# Altium schematic sheet MCU.SchDoc
size 420 x 297 mm; SheetNumber: 1; Scale: {Мш.}; PageSetup: Record=PageOptions|CenterHorizontal=False|CenterVertical=False|PrintScale=0.49|XCorrection=0.00|YCorrection=0.00|PrintKind=1|BorderSize=5000000|LeftOffset=0|BottomOffset=0|Orientation=1|PaperLength=1000|PaperWidth=1000|Scale=100|PaperSource=15|PrintQuality=600|MediaType=1|DitherType=10|PrintScaleMode=1|PaperKind=A4; ProcessInspection: {Т.контр.}; Mass: {М.}; NormInspection: {Н.контр.}; Letter1Column: {}; Letter2Column: {}; Letter3Column: {}; DocumentType: {Документ}
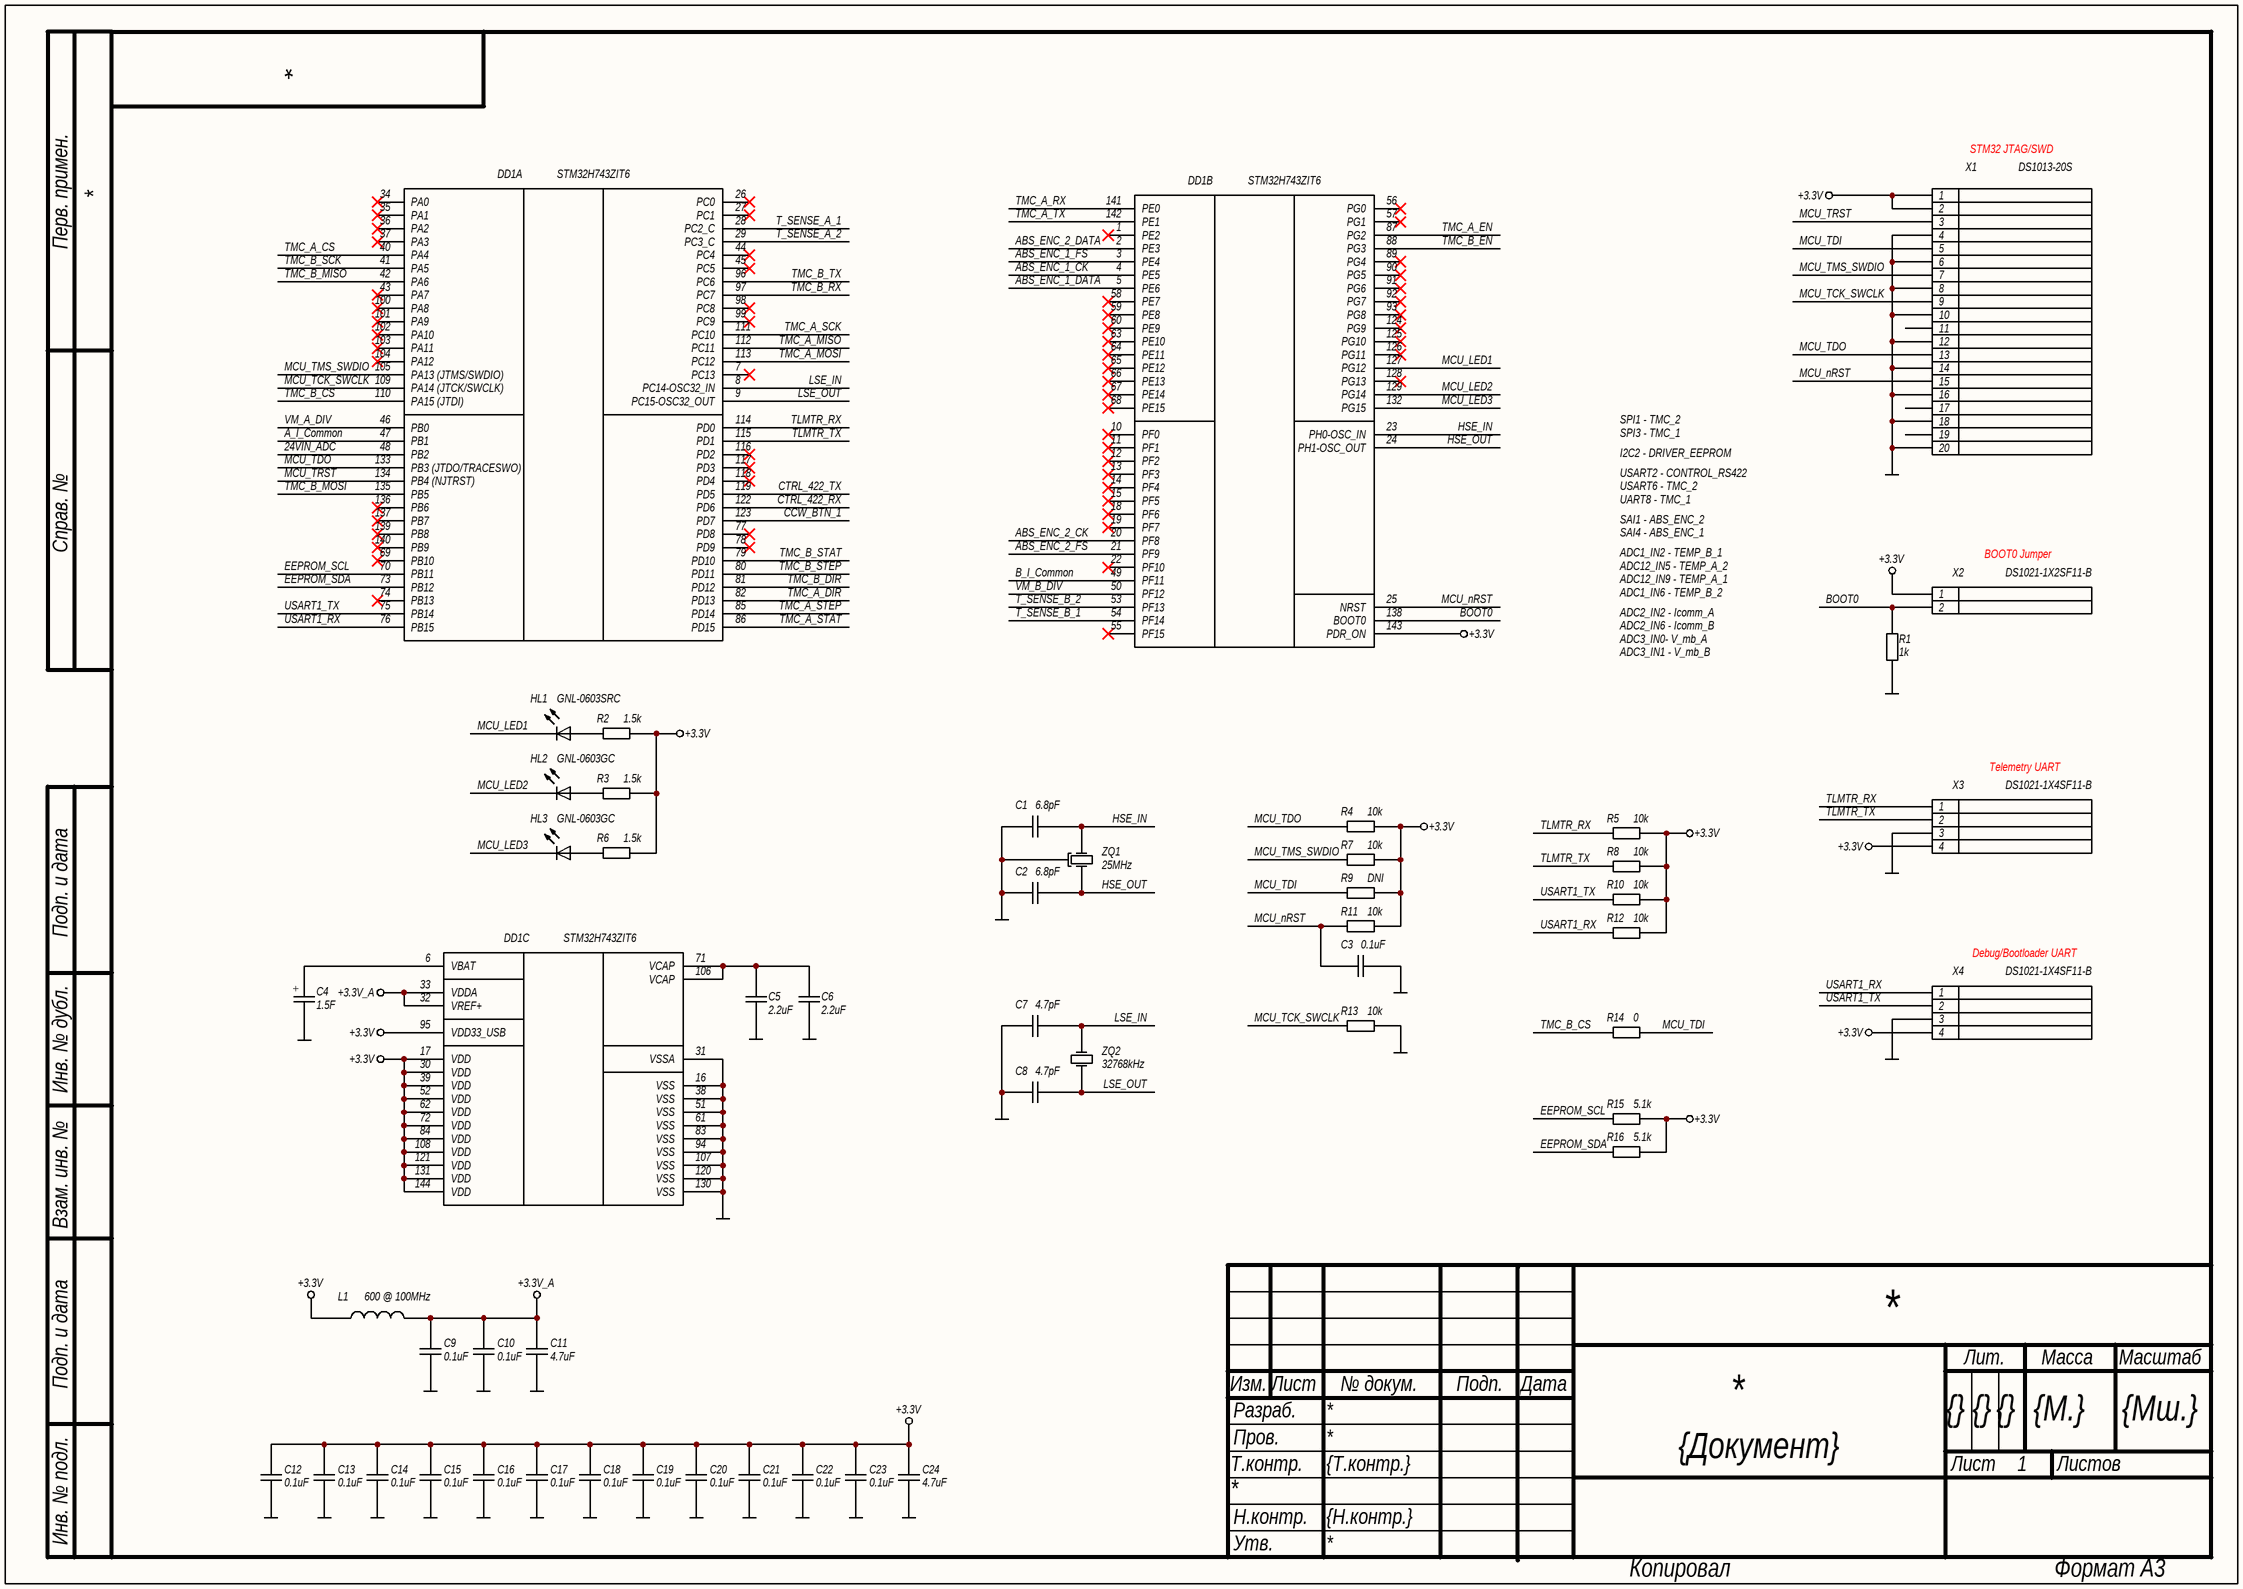
[diagram p0: MCU.SchDoc]

## Parts
C1  6.8pF  [C0603N]
C2  6.8pF  [C0603N]
C3  0.1uF  [C0603N]
C4  1.5F  [KR-5R5H155-R]
C5  2.2uF  [C0603N]
C6  2.2uF  [C0603N]
C7  4.7pF  [C0603N]
C8  4.7pF  [C0603N]
C9  0.1uF  [C0603N]
C10  0.1uF  [C0603N]
C11  4.7uF  [C0603N]
C12  0.1uF  [C0603N]
C13  0.1uF  [C0603N]
C14  0.1uF  [C0603N]
C15  0.1uF  [C0603N]
C16  0.1uF  [C0603N]
C17  0.1uF  [C0603N]
C18  0.1uF  [C0603N]
C19  0.1uF  [C0603N]
C20  0.1uF  [C0603N]
C21  0.1uF  [C0603N]
C22  0.1uF  [C0603N]
C23  0.1uF  [C0603N]
C24  4.7uF  [C0603N]
DD1  STM32H743ZIT6  [LQFP144]  (parts A,B,C of 3)
HL1  GNL-0603SRC  [LED0603]
HL2  GNL-0603GC  [LED0603]
HL3  GNL-0603GC  [LED0603]
L1  600 @ 100MHz  [FB0603N]
R1  1k  [R0603N]
R2  1.5k  [R0603N]
R3  1.5k  [R0603N]
R4  10k  [R0603N]
R5  10k  [R0603N]
R6  1.5k  [R0603N]
R7  10k  [R0603N]
R8  10k  [R0603N]
R9  DNI  [R0603N]  (no BOM)
R10  10k  [R0603N]
R11  10k  [R0603N]
R12  10k  [R0603N]
R13  10k  [R0603N]
R14  0  [R0603N]
R15  5.1k  [R0603N]
R16  5.1k  [R0603N]
X1  DS1013-20S  [2.54_2X10_HEADER_BOX]
X2  DS1021-1X2SF11-B  [2.54_2X1_HEADER]
X3  DS1021-1X4SF11-B  [2.54_4X1_HEADER]
X4  DS1021-1X4SF11-B  [2.54_4X1_HEADER]
ZQ1  25MHz  [NX3225GA]
ZQ2  32768kHz  [NX3215SA]

## Nets
+3.3V: C12.2 C13.2 C14.2 C15.2 C16.2 C17.2 C18.2 C19.2 C20.2 C21.2 C22.2 C23.2 C24.2 DD1.17(VDD) DD1.30(VDD) DD1.39(VDD) DD1.52(VDD) DD1.62(VDD) DD1.72(VDD) DD1.84(VDD) DD1.95(VDD33_USB) DD1.108(VDD) DD1.121(VDD) DD1.131(VDD) DD1.143(PDR_ON) DD1.144(VDD) L1.1 R2.1 R3.1 R4.1 R5.1 R6.1 R7.1 R8.1 R9.1 R10.1 R11.1 R12.1 R15.1 R16.1 X1.1 X1.2 X2.1 X3.4 X4.4
+3.3V_A: C9.2 C10.2 C11.2 DD1.32(VREF+) DD1.33(VDDA) L1.2
GND: C1.2 C2.2 C3.1 C4.1 C5.1 C6.1 C7.2 C8.2 C9.1 C10.1 C11.1 C12.1 C13.1 C14.1 C15.1 C16.1 C17.1 C18.1 C19.1 C20.1 C21.1 C22.1 C23.1 C24.1 DD1.16(VSS) DD1.31(VSSA) DD1.38(VSS) DD1.51(VSS) DD1.61(VSS) DD1.83(VSS) DD1.94(VSS) DD1.107(VSS) DD1.120(VSS) DD1.130(VSS) R1.2 R13.2 X1.4 X1.6 X1.8 X1.10 X1.12 X1.14 X1.16 X1.18 X1.20 X3.3 X4.3 ZQ1.2
24VIN_ADC: DD1.48(PB2)
A_I_Common: DD1.47(PB1)
ABS_ENC_1_CK: DD1.4(PE5)
ABS_ENC_1_DATA: DD1.5(PE6)
ABS_ENC_1_FS: DD1.3(PE4)
ABS_ENC_2_CK: DD1.20(PF8)
ABS_ENC_2_DATA: DD1.2(PE3)
ABS_ENC_2_FS: DD1.21(PF9)
B_I_Common: DD1.49(PF11)
BOOT0: DD1.138(BOOT0) R1.1 X2.2
CCW_BTN_1: DD1.123(PD7)
CTRL_422_RX: DD1.122(PD6)
CTRL_422_TX: DD1.119(PD5)
EEPROM_SCL: DD1.70(PB11) R15.2
EEPROM_SDA: DD1.73(PB12) R16.2
HSE_IN: C1.1 DD1.23(PH0-OSC_IN) ZQ1.1
HSE_OUT: C2.1 DD1.24(PH1-OSC_OUT) ZQ1.3
LSE_IN: C7.1 DD1.8(PC14-OSC32_IN) ZQ2.2
LSE_OUT: C8.1 DD1.9(PC15-OSC32_OUT) ZQ2.1
MCU_LED1: DD1.127(PG12) HL1.1(K)
MCU_LED2: DD1.129(PG14) HL2.1(K)
MCU_LED3: DD1.132(PG15) HL3.1(K)
MCU_nRST: C3.2 DD1.25(NRST) R11.2 X1.15
MCU_TCK_SWCLK: DD1.109(PA14_(JTCK/SWCLK)) R13.1 X1.9
MCU_TDI: R9.2 R14.1 X1.5
MCU_TDO: DD1.133(PB3_(JTDO/TRACESWO)) R4.2 X1.13
MCU_TMS_SWDIO: DD1.105(PA13_(JTMS/SWDIO)) R7.2 X1.7
MCU_TRST: DD1.134(PB4_(NJTRST)) X1.3
T_SENSE_A_1: DD1.28(PC2_C)
T_SENSE_A_2: DD1.29(PC3_C)
T_SENSE_B_1: DD1.54(PF14)
T_SENSE_B_2: DD1.53(PF13)
TLMTR_RX: DD1.114(PD0) R5.2 X3.1
TLMTR_TX: DD1.115(PD1) R8.2 X3.2
TMC_A_CS: DD1.40(PA4)
TMC_A_DIR: DD1.82(PD13)
TMC_A_EN: DD1.87(PG2)
TMC_A_MISO: DD1.112(PC11)
TMC_A_MOSI: DD1.113(PC12)
TMC_A_RX: DD1.141(PE0)
TMC_A_SCK: DD1.111(PC10)
TMC_A_STAT: DD1.86(PD15)
TMC_A_STEP: DD1.85(PD14)
TMC_A_TX: DD1.142(PE1)
TMC_B_CS: DD1.110(PA15_(JTDI)) R14.2
TMC_B_DIR: DD1.81(PD12)
TMC_B_EN: DD1.88(PG3)
TMC_B_MISO: DD1.42(PA6)
TMC_B_MOSI: DD1.135(PB5)
TMC_B_RX: DD1.97(PC7)
TMC_B_SCK: DD1.41(PA5)
TMC_B_STAT: DD1.79(PD10)
TMC_B_STEP: DD1.80(PD11)
TMC_B_TX: DD1.96(PC6)
USART1_RX: DD1.76(PB15) R12.2 X4.1
USART1_TX: DD1.75(PB14) R10.2 X4.2
VM_A_DIV: DD1.46(PB0)
VM_B_DIV: DD1.50(PF12)
NetC4_2: C4.2 DD1.6(VBAT)
NetC5_2: C5.2 C6.2 DD1.71(VCAP) DD1.106(VCAP)
NetHL1_2: HL1.2(A) R2.2
NetHL2_2: HL2.2(A) R3.2
NetHL3_2: HL3.2(A) R6.2

Not connected (* = marked no-connect by the designer): DD1 1(PE2)* 7(PC13)* 10(PF0)* 11(PF1)* 12(PF2)* 13(PF3)* 14(PF4)* 15(PF5)* 18(PF6)* 19(PF7)* 22(PF10)* 26(PC0)* 27(PC1)* 34(PA0)* 35(PA1)* 36(PA2)* 37(PA3)* 43(PA7)* 44(PC4)* 45(PC5)* 55(PF15)* 56(PG0)* 57(PG1)* 58(PE7)* 59(PE8)* 60(PE9)* 63(PE10)* 64(PE11)* 65(PE12)* 66(PE13)* 67(PE14)* 68(PE15)* 69(PB10)* 74(PB13)* 77(PD8)* 78(PD9)* 89(PG4)* 90(PG5)* 91(PG6)* 92(PG7)* 93(PG8)* 98(PC8)* 99(PC9)* 100(PA8)* 101(PA9)* 102(PA10)* 103(PA11)* 104(PA12)* 116(PD2)* 117(PD3)* 118(PD4)* 124(PG9)* 125(PG10)* 126(PG11)* 128(PG13)* 136(PB6)* 137(PB7)* 139(PB8)* 140(PB9)*; X1 11 17 19

## Notes on the sheet
- STM32 JTAG/SWD
- SPI1 - TMC_2
- SPI3 - TMC_1
- I2C2 - DRIVER_EEPROM
- USART2 - CONTROL_RS422
- USART6 - TMC_2
- UART8 - TMC_1
- SAI1 - ABS_ENC_2
- ADC1_IN2 - TEMP_B_1
- ADC12_IN5 - TEMP_A_2
- ADC12_IN9 - TEMP_A_1
- ADC1_IN6 - TEMP_B_2
- SAI4 - ABS_ENC_1
- BOOT0 Jumper
- ADC2_IN2 - Icomm_A
- ADC2_IN6 - Icomm_B
- ADC3_IN0- V_mb_A
- ADC3_IN1 - V_mb_B
- Telemetry UART
- (near X4) Debug/Bootloader UART
- Перв. примен.
- Справ. №
- Подп. и дата
- Инв. № дубл.
- Взам. инв. №
- Изм.
- Лист
- № докум.
- Подп.
- Дата
- Лит.
- Масса
- Масштаб
- Т.контр.
- Пров.
- Разраб.
- Листов
- Инв. № подл.
- Н.контр.
- Утв.
- Копировал
- Формат А3
- (in symbol KR-5R5H155-R) +

## Library data of the parts
C1 C2 = CC0603CRNPO9BN6R8: Конденсатор; Точность: ±0.25pF; Напряжение: 50V; Диэлектрик: NP0; Производитель: YAGEO; Описание: 4.7 pF ±0.25pF 50V Ceramic Capacitor C0G, NP0 0603 (1608 Metric); Корпус: 0603 (1608 Metric); Температурный диапазон: -55°C ~ 125°C; Вид монтажа: SMD; Артикул: CC0603CRNPO9BN6R8; Номинал: 6.8pF; Строка для документации: https://www.yageo.com/upload/media/product/productsearch/datasheet/mlcc/UPY-GP_NP0_16V-to-50V_18.pdf; Тип элемента: Конденсатор
C3 C9 C10 C12-C23 = CL10B104KB8NNNC: Конденсатор; Точность: 10%; Напряжение: 50V; Диэлектрик: X7R; Производитель: Samsung Electro-Mechanics; Описание: 0.1 µF ±10% 50V Ceramic Capacitor X7R 0603 (1608 Metric); Корпус: 0603 (1608 Metric); Температурный диапазон: -55°C ~ 125°C; Вид монтажа: SMD; Артикул: CL10B104KB8NNNC; Номинал: 0.1uF; Строка для документации: https://mm.digikey.com/Volume0/opasdata/d220001/medias/docus/609/CL10B104KB8NNNC_Spec.pdf; Тип элемента: Конденсатор
C4 = KR-5R5H155-R: Ионистор; Точность: -20%, +80%; Напряжение: 5.5V; Диэлектрик: EDLC; Производитель: Eaton - Electronics Division; Описание: 1.5 F (EDLC) Supercapacitor 5.5 V Axial, Can - Horizontal 30Ohm @ 1kHz 1000 Hrs @ 70°C; Корпус: 19.00mm dia x 6.5mm; Температурный диапазон: -25°C ~ 70°C; Вид монтажа: Through Hole; Тип элемента: Конденсатор; Артикул: KR-5R5H155-R; Номинал: 1.5F; Строка для документации: https://www.eaton.com/content/dam/eaton/products/electronic-components/resources/data-sheet/eaton-kr-supercapacitors-coin-cells-data-sheet.pdf
C5 C6 = CL10A225KO8NNNC: Конденсатор; Точность: 10%; Напряжение: 16V; Диэлектрик: X5R; Производитель: Samsung Electro-Mechanics; Описание: 2.2 µF ±10% 16V Ceramic Capacitor X5R 0603 (1608 Metric); Корпус: 0603 (1608 Metric); Температурный диапазон: -55°C ~ 85°C; Вид монтажа: SMD; Артикул: CL10A225KO8NNNC; Номинал: 2.2uF; Строка для документации: https://mm.digikey.com/Volume0/opasdata/d220001/medias/docus/421/CL10A225KO8NNNC_Spec.pdf; Тип элемента: Конденсатор
C7 C8 = CC0603CRNPO9BN4R7: Конденсатор; Точность: ±0.25pF; Напряжение: 50V; Диэлектрик: NP0; Производитель: YAGEO; Описание: 4.7 pF ±0.25pF 50V Ceramic Capacitor C0G, NP0 0603 (1608 Metric); Корпус: 0603 (1608 Metric); Температурный диапазон: -55°C ~ 125°C; Вид монтажа: SMD; Артикул: CC0603CRNPO9BN4R7; Номинал: 4.7pF; Строка для документации: https://www.yageo.com/upload/media/product/productsearch/datasheet/mlcc/UPY-GP_NP0_16V-to-50V_18.pdf; Тип элемента: Конденсатор
C11 C24 = CL10A475KO8NNNC: Конденсатор; Точность: 10%; Напряжение: 16V; Диэлектрик: X5R; Производитель: Samsung Electro-Mechanics; Описание: 4.7 µF ±10% 16V Ceramic Capacitor X5R 0603 (1608 Metric); Корпус: 0603 (1608 Metric); Температурный диапазон: -55°C ~ 85°C; Вид монтажа: SMD; Артикул: CL10A475KO8NNNC; Номинал: 4.7uF; Строка для документации: https://mm.digikey.com/Volume0/opasdata/d220001/medias/docus/2328/CL10A475KO8NNNC_Spec.pdf; Тип элемента: Конденсатор
DD1 = STM32H743ZIT6: Микросхема микроконтроллер; Производитель: STMicroelectronics; Описание: ARM® Cortex®-M7 STM32H7 Microcontroller IC 32-Bit Single-Core 480MHz 2MB (2M x 8) FLASH 144-LQFP (20x20); Корпус: 144-LQFP (20x20); Температурный диапазон: -40°C ~ 85°C (TA); Вид монтажа: SMD; Артикул: STM32H743ZIT6; Строка для документации: https://www.st.com/resource/en/datasheet/stm32h743bi.pdf; Тип элемента: Микросхема
HL1 = GNL-0603SRC: Светодиод; Прямой ток: 20mA; Напряжение: 2V; Яркость: 15mcd; Цвет: Зеленый; Длина волны: 660nm; Производитель: G-nor Electronics; Описание: Green 567nm LED Indication - Discrete 2V 0603 (1608 Metric); Корпус: 0603 (1608 Metric); Температурный диапазон: -40°C ~ 80°C; Вид монтажа: SMD; Тип элемента: Диод светоизлучающий; Артикул: GNL-0603SRC; Строка для документации: https://www.g-nor.com/Uploads/Ed/file/20210517/1621223120713818.doc
HL2 HL3 = GNL-0603GC: Светодиод; Прямой ток: 20mA; Напряжение: 2V; Цвет: Зеленый; Длина волны: 567nm; Производитель: G-nor Electronics; Описание: Green 567nm LED Indication - Discrete 2V 0603 (1608 Metric); Корпус: 0603 (1608 Metric); Температурный диапазон: -40°C ~ 80°C; Вид монтажа: SMD; Тип элемента: Диод светоизлучающий; Артикул: GNL-0603GC; Яркость: LED; Строка для документации: https://www.g-nor.com/Uploads/Ed/file/20210517/1621223120713818.doc
L1 = BLM18AG601SN1D: Фильтр ЭМП индуктивный; Ток: 500mA; Сопротивление: 380m; Тип: Ferrite Bead; Производитель: Murata Electronics; Описание: 600 Ohms @ 100 MHz 1 Ferrite Bead 0603 (1608 Metric) 500mA 380mOhm; Корпус: 0603 (1608 Metric); Температурный диапазон: -55°C ~ 125°C; Вид монтажа: SMD; Артикул: BLM18AG601SN1D; Номинал: 600 @ 100MHz; Строка для документации: https://www.murata.com/en-us/products/productdata/8796738650142/ENFA0003.pdf; Тип элемента: Фильтр ЭМП
R1 = RC0603FR-071KL: Резистор; Точность: 1%; ТКС: ±100ppm/°C; Напряжение: 75V; Производитель: YAGEO; Описание: 1 kOhms ±1% 0.1W, 1/10W Chip Resistor 0603 (1608 Metric) Moisture Resistant Thick Film; Корпус: 0603 (1608 Metric); Температурный диапазон: -55°C ~ 155°C; Вид монтажа: SMD; Артикул: RC0603FR-071KL; Номинал: 1k; Строка для документации: https://www.yageo.com/upload/media/product/app/datasheet/rchip/pyu-rc_group_51_rohs_l.pdf; Тип элемента: Резистор
R2 R3 R6 = RC0603FR-071K5L: Резистор; Точность: 1%; ТКС: ±100ppm/°C; Напряжение: 75V; Производитель: YAGEO; Описание: 1.5 kOhms ±1% 0.1W, 1/10W Chip Resistor 0603 (1608 Metric) Moisture Resistant Thick Film; Корпус: 0603 (1608 Metric); Температурный диапазон: -55°C ~ 155°C; Вид монтажа: SMD; Артикул: RC0603FR-071K5L; Номинал: 1.5k; Строка для документации: https://www.yageo.com/upload/media/product/app/datasheet/rchip/pyu-rc_group_51_rohs_l.pdf; Тип элемента: Резистор
R4 R5 R7-R13 = RC0603FR-0710KL: Резистор; Точность: 1%; ТКС: ±100ppm/°C; Напряжение: 75V; Производитель: YAGEO; Описание: 10 kOhms ±1% 0.1W, 1/10W Chip Resistor 0603 (1608 Metric) Moisture Resistant Thick Film; Корпус: 0603 (1608 Metric); Температурный диапазон: -55°C ~ 155°C; Вид монтажа: SMD; Артикул: RC0603FR-0710KL; Строка для документации: https://www.yageo.com/upload/media/product/app/datasheet/rchip/pyu-rc_group_51_rohs_l.pdf; Тип элемента: Резистор
  R4 R5 R7 R8 R10-R13: Номинал: 10k
  R9: Номинал: DNI
R14 = RC0603FR-070RL: Резистор; Точность: 1%; ТКС: ±100ppm/°C; Напряжение: 75V; Производитель: YAGEO; Описание: 0 Ohms Jumper Chip Resistor 0603 (1608 Metric) Moisture Resistant Thick Film; Корпус: 0603 (1608 Metric); Температурный диапазон: -55°C ~ 155°C; Вид монтажа: SMD; Артикул: RC0603FR-070RL; Номинал: 0; Строка для документации: https://www.yageo.com/upload/media/product/app/datasheet/rchip/pyu-rc_group_51_rohs_l.pdf; Тип элемента: Резистор
R15 R16 = RC0603FR-075K1L: Резистор; Точность: 1%; ТКС: ±100ppm/°C; Напряжение: 75V; Производитель: YAGEO; Описание: 5.1 kOhms ±1% 0.1W, 1/10W Chip Resistor 0603 (1608 Metric) Moisture Resistant Thick Film; Корпус: 0603 (1608 Metric); Температурный диапазон: -55°C ~ 155°C; Вид монтажа: SMD; Артикул: RC0603FR-075K1L; Номинал: 5.1k; Строка для документации: https://www.yageo.com/upload/media/product/app/datasheet/rchip/pyu-rc_group_51_rohs_l.pdf; Тип элемента: Резистор
X1 = DS1013-20S: Разъем, 20 контактов; Тип разъема: Header, Male Pin; Количество контактов: 20; Шаг контактов: 2.54mm; Ток: 3A; Напряжение: 250V; Производитель: Connfly electronic (Zhenqin); Описание: Connector Header Through Hole 30 position 0.100" (2.54mm); Температурный диапазон: -40°C ~ 105°C; Вид монтажа: Through Hole; Артикул: DS1013-20S; Строка для документации: http://cn.connfly.group/static/upload/file/pdf/DS1013.pdf; Тип элемента: Разъем
X2 = DS1021-1X2SF11-B: Разъем, 2 контакта; Тип разъема: Header, Male Pin; Количество контактов: 2; Шаг контактов: 2.54mm; Ток: 3A; Напряжение: 250V; Производитель: Connfly electronic (Zhenqin); Описание: Connector Header Through Hole 2 position 0.100" (2.54mm); Температурный диапазон: -40°C ~ 105°C; Вид монтажа: Through Hole; Артикул: DS1021-1X2SF11-B; Строка для документации: http://cn.connfly.group/static/upload/file/pdf/DS1021.pdf; Тип элемента: Разъем
X3 X4 = DS1021-1X4SF11-B: Разъем, 4 контакта; Тип разъема: Header, Male Pin; Количество контактов: 4; Шаг контактов: 2.54mm; Ток: 3A; Напряжение: 250V; Производитель: Connfly electronic (Zhenqin); Описание: Connector Header Through Hole 4 position 0.100" (2.54mm); Температурный диапазон: -40°C ~ 105°C; Вид монтажа: Through Hole; Артикул: DS1021-1X4SF11-B; Строка для документации: http://cn.connfly.group/static/upload/file/pdf/DS1021.pdf; Тип элемента: Разъем
ZQ1 = NX3225GA-25.000M: Кварцевый резонатор, экранированный; Точность: ±20ppm; Описание: 25 MHz ±20ppm Crystal 8pF 50 Ohms 4-SMD, No Lead; Тип: MHz Crystal; Производитель: NDK America, Inc.; Температурный диапазон: -40°C ~ 85°C; Корпус: 3.20mm x 2.50mm; Вид монтажа: SMD; Артикул: NX3225GA-25.000M; Частота: 25MHz; Строка для документации: https://www.ndk.com/en/products/upload/lineup/pdf/NDKX03-00006_en.pdf; Тип элемента: Кварцевый резонатор
ZQ2 = NX3215SA-32.768K: Кварцевый резонатор; Точность: ±20ppm; Описание: 32.768 kHz ±20ppm Crystal 7pF 70 kOhms 2-SMD, No Lead; Тип: kHz Crystal (Tuning Fork); Производитель: NDK America, Inc.; Температурный диапазон: -40°C ~ 85°C; Корпус: 3.20mm x 1.50mm; Вид монтажа: SMD; Артикул: NX3215SA-32.768K; Частота: 32768kHz; Строка для документации: https://www.ndk.com/images/products/catalog/c_NX3215SA_e.pdf; Тип элемента: Кварцевый резонатор